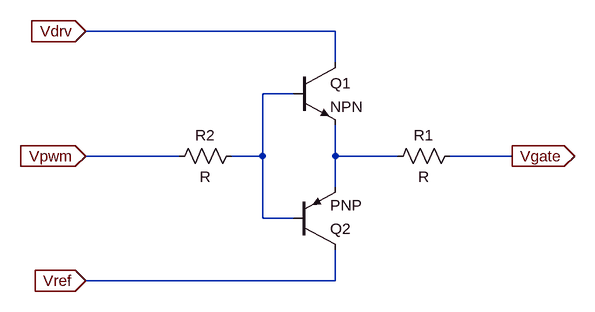
[diagram p0: schematic mosdrive.asc]
mosdrive.asc, the LTspice schematic file:
Version 4
SHEET 1 880 680
WIRE 208 48 -176 48
WIRE 208 96 208 48
WIRE 144 144 96 144
WIRE -32 240 -176 240
WIRE 96 240 96 144
WIRE 96 240 48 240
WIRE 208 240 208 192
WIRE 304 240 208 240
WIRE 480 240 384 240
WIRE 208 288 208 240
WIRE 96 336 96 240
WIRE 144 336 96 336
WIRE 208 432 208 384
WIRE 208 432 -176 432
FLAG -176 48 Vdrv
IOPIN -176 48 In
FLAG 480 240 Vgate
IOPIN 480 240 Out
FLAG -176 240 Vpwm
IOPIN -176 240 In
FLAG -176 432 Vref
IOPIN -176 432 In
SYMBOL npn 144 96 R0
SYMATTR InstName Q1
SYMBOL pnp 144 384 M180
SYMATTR InstName Q2
SYMBOL res 400 224 R90
WINDOW 0 0 56 VBottom 2
WINDOW 3 32 56 VTop 2
SYMATTR InstName R1
SYMBOL res 64 224 R90
WINDOW 0 0 56 VBottom 2
WINDOW 3 32 56 VTop 2
SYMATTR InstName R2

The netlist it stands for:
* mosdrive.asc
Q1 Vdrv N001 N002 0 NPN
Q2 Vref N001 N002 0 PNP
R1 Vgate N002 R
R2 N001 Vpwm R
.model NPN NPN
.model PNP PNP
.lib standard.bjt
.backanno
.end